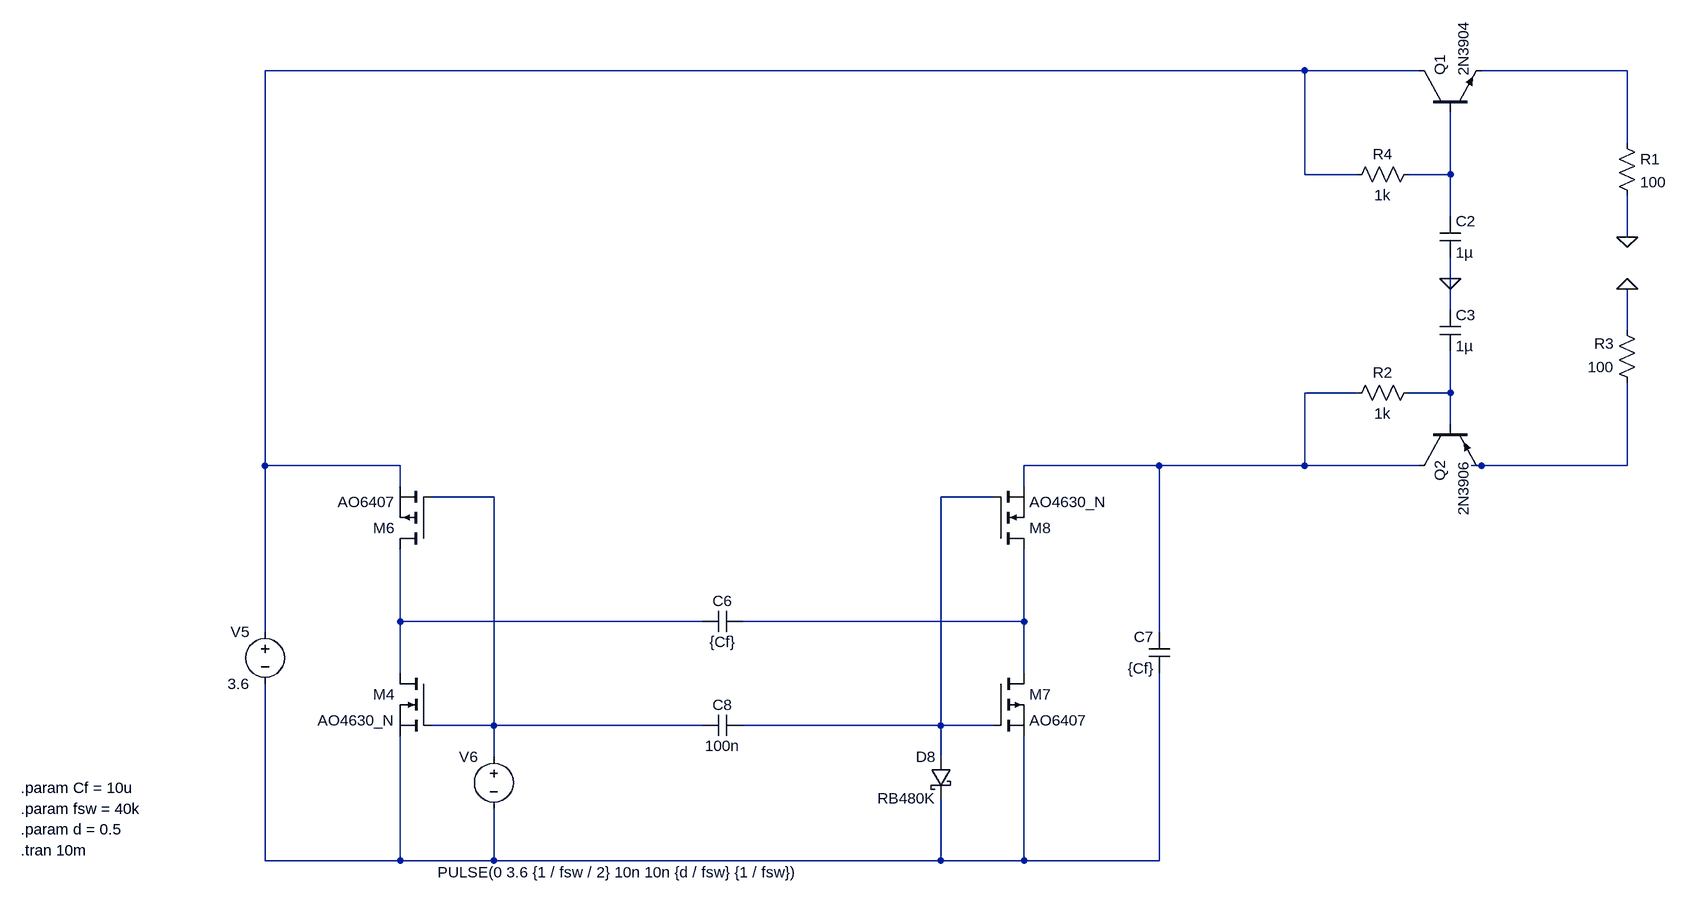
[diagram p0: schematic H-bridge_charge_pump_negative.asc]
H-bridge_charge_pump_negative.asc, the LTspice schematic file:
Version 4
SHEET 1 11460 3748
WIRE 976 -256 -624 -256
WIRE 1152 -256 976 -256
WIRE 1472 -256 1248 -256
WIRE 1472 -144 1472 -256
WIRE 976 -96 976 -256
WIRE 1056 -96 976 -96
WIRE 1200 -96 1200 -192
WIRE 1200 -96 1136 -96
WIRE 1200 -32 1200 -96
WIRE 1472 0 1472 -64
WIRE 1200 64 1200 32
WIRE 1200 112 1200 64
WIRE 1472 144 1472 80
WIRE 1056 240 976 240
WIRE 1200 240 1200 176
WIRE 1200 240 1136 240
WIRE 1200 288 1200 240
WIRE -624 352 -624 -256
WIRE -416 352 -624 352
WIRE 752 352 544 352
WIRE 976 352 976 240
WIRE 976 352 752 352
WIRE 1152 352 976 352
WIRE 1248 352 1232 352
WIRE 1472 352 1472 224
WIRE 1472 352 1248 352
WIRE -416 384 -416 352
WIRE 544 384 544 352
WIRE -272 400 -368 400
WIRE 496 400 416 400
WIRE -416 592 -416 480
WIRE 48 592 -416 592
WIRE 544 592 544 480
WIRE 544 592 112 592
WIRE -624 608 -624 352
WIRE 752 608 752 352
WIRE -416 672 -416 592
WIRE 544 672 544 592
WIRE -272 752 -272 400
WIRE -272 752 -368 752
WIRE 48 752 -272 752
WIRE 416 752 416 400
WIRE 416 752 112 752
WIRE 496 752 416 752
WIRE -272 800 -272 752
WIRE 416 800 416 752
WIRE -624 960 -624 688
WIRE -416 960 -416 768
WIRE -416 960 -624 960
WIRE -272 960 -272 880
WIRE -272 960 -416 960
WIRE 416 960 416 864
WIRE 416 960 -272 960
WIRE 544 960 544 768
WIRE 544 960 416 960
WIRE 752 960 752 672
WIRE 752 960 544 960
FLAG 1200 64 0
FLAG 1472 0 0
FLAG 1472 80 0
SYMBOL voltage -272 784 M0
WINDOW 123 0 0 Left 0
WINDOW 39 0 0 Left 0
WINDOW 3 -469 194 Left 2
SYMATTR Value PULSE(0 3.6 {1 / fsw / 2} 10n 10n {d / fsw} {1 / fsw})
SYMATTR InstName V6
SYMBOL cap 112 576 R90
WINDOW 0 0 32 VBottom 2
WINDOW 3 32 32 VTop 2
SYMATTR InstName C6
SYMATTR Value {Cf}
SYMBOL cap 768 672 R180
WINDOW 0 24 56 Left 2
WINDOW 3 24 8 Left 2
SYMATTR InstName C7
SYMATTR Value {Cf}
SYMBOL nmos -368 672 M0
SYMATTR InstName M4
SYMATTR Value AO4630_N
SYMBOL pmos -368 480 R180
SYMATTR InstName M6
SYMATTR Value AO6407
SYMBOL pmos 496 672 R0
SYMATTR InstName M7
SYMATTR Value AO6407
SYMBOL cap 48 736 M90
WINDOW 0 0 32 VBottom 2
WINDOW 3 32 32 VTop 2
SYMATTR InstName C8
SYMATTR Value 100n
SYMBOL schottky 432 800 M0
SYMATTR InstName D8
SYMATTR Value RB480K
SYMATTR Description Diode
SYMATTR Type diode
SYMBOL nmos 496 480 M180
SYMATTR InstName M8
SYMATTR Value AO4630_N
SYMBOL voltage -624 592 M0
WINDOW 123 0 0 Left 0
WINDOW 39 0 0 Left 0
SYMATTR InstName V5
SYMATTR Value 3.6
SYMBOL npn 1152 -192 R270
SYMATTR InstName Q1
SYMATTR Value 2N3904
SYMBOL res 1456 -160 R0
SYMATTR InstName R1
SYMATTR Value 100
SYMBOL res 1152 224 R90
WINDOW 0 0 56 VBottom 2
WINDOW 3 32 56 VTop 2
SYMATTR InstName R2
SYMATTR Value 1k
SYMBOL pnp 1152 288 M90
SYMATTR InstName Q2
SYMATTR Value 2N3906
SYMBOL res 1488 240 R180
WINDOW 0 36 76 Left 2
WINDOW 3 36 40 Left 2
SYMATTR InstName R3
SYMATTR Value 100
SYMBOL cap 1184 -32 R0
SYMATTR InstName C2
SYMATTR Value 1µ
SYMBOL cap 1184 112 R0
SYMATTR InstName C3
SYMATTR Value 1µ
SYMBOL res 1152 -112 R90
WINDOW 0 0 56 VBottom 2
WINDOW 3 32 56 VTop 2
SYMATTR InstName R4
SYMATTR Value 1k
TEXT -1000 880 Left 2 !.param fsw = 40k
TEXT -1000 912 Left 2 !.param d = 0.5
TEXT -1000 848 Left 2 !.param Cf = 10u
TEXT -1000 944 Left 2 !.tran 10m

The netlist it stands for:
* H-bridge_charge_pump_negative.asc
V6 N007 N011 PULSE(0 3.6 {1 / fsw / 2} 10n 10n {d / fsw} {1 / fsw})
C6 N010 N009 {Cf}
C7 N011 N004 {Cf}
M4 N009 N007 N011 N011 AO4630_N
M6 N009 N007 N001 N001 AO6407
M7 N010 N008 N011 N011 AO6407
C8 N007 N008 100n
D8 N008 N011 RB480K
M8 N010 N008 N004 N004 AO4630_N
V5 N001 N011 3.6
Q1 N001 N003 N002 0 2N3904
R1 N002 0 100
R2 N005 N004 1k
Q2 N004 N005 N006 0 2N3906
R3 N006 0 100
C2 N003 0 1µ
C3 0 N005 1µ
R4 N003 N001 1k
.model D D
.lib standard.dio
.model NPN NPN
.model PNP PNP
.lib standard.bjt
.model NMOS NMOS
.model PMOS PMOS
.lib standard.mos
.param fsw = 40k
.param d = 0.5
.param Cf = 10u
.tran 10m
.backanno
.end